# EAGLE design Braumister V.2.0 (EAGLE 6.1)
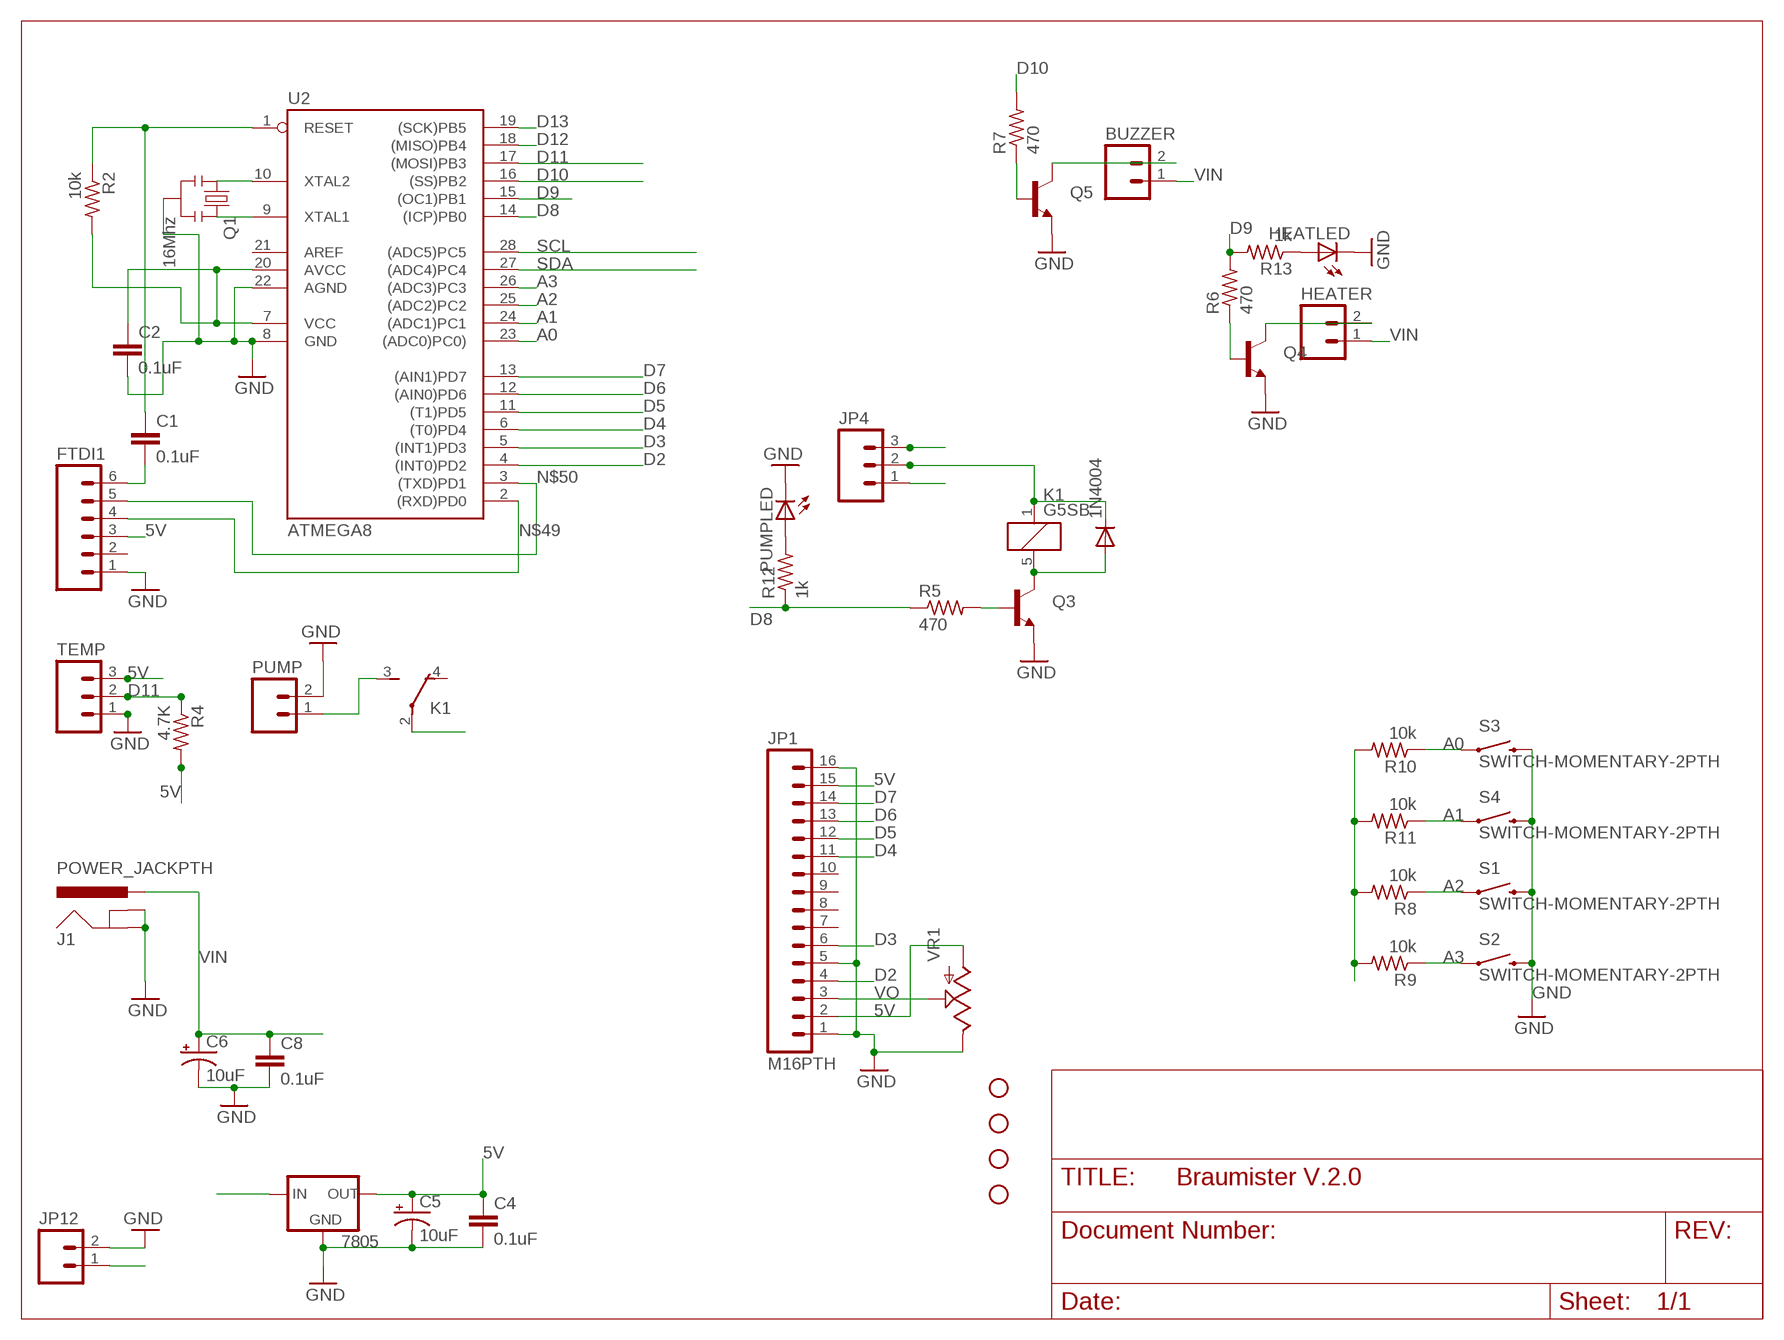
[diagram p0: schematic, sheet 1]

## Parts
1N4004  DIODEPTH  [DIODE-1N4001]
7805  V_REG_78XX  [TO220AHV]
BUZZER  M023.5MM  [SCREWTERMINAL-3.5MM-2]
C1  0.1uF  CAPPTH  [CAP-PTH-SMALL]
C2  0.1uF  CAPPTH  [CAP-PTH-SMALL]
C4  0.1uF  CAPPTH  [CAP-PTH-SMALL]
C5  10uF  CAP_POL6.3MMPTH  [CAP6.3MM2.5MM]
C6  10uF  CAP_POL6.3MMPTH  [CAP6.3MM2.5MM]
C8  0.1uF  CAPPTH  [CAP-PTH-SMALL]
FTDI1  M06SIP  [1X06]
HEATER  M023.5MM  [SCREWTERMINAL-3.5MM-2]
HEATLED  LED3MM  [LED3MM]
J1  POWER_JACKPTH  [POWER_JACK_PTH]
JP1  M16PTH  [1X16]
JP2  STAND-OFF  [STAND-OFF]
JP4  M03LOCK  [1X03_LOCK]
JP7  STAND-OFF  [STAND-OFF]
JP9  STAND-OFF  [STAND-OFF]
JP10  STAND-OFF  [STAND-OFF]
JP12  M02PTH  [1X02]
K1  G5SB  [G5SB]
PUMP  M023.5MM  [SCREWTERMINAL-3.5MM-2]
PUMPLED  LED3MM  [LED3MM]
Q1  16Mhz  RESONATORPTH  [RESONATOR-PTH]
Q3  TRANSISTOR_NPNTO-92-AMMO  [TO-92-AMMO]
Q4  TRANSISTOR_NPNTO-92-AMMO  [TO-92-AMMO]
Q5  TRANSISTOR_NPNTO-92-AMMO  [TO-92-AMMO]
R2  10k  R-US_0204/7  [0204/7]
R4  4.7K  R-US_0204/7  [0204/7]
R5  470  R-US_0204/7  [0204/7]
R6  470  R-US_0204/7  [0204/7]
R7  470  R-US_0204/7  [0204/7]
R8  10k  R-US_0204/7  [0204/7]
R9  10k  R-US_0204/7  [0204/7]
R10  10k  R-US_0204/7  [0204/7]
R11  10k  R-US_0204/7  [0204/7]
R12  1k  R-US_0204/7  [0204/7]
R13  1k  R-US_0204/7  [0204/7]
S1  SWITCH-MOMENTARY-2PTH  [TACTILE-PTH]
S2  SWITCH-MOMENTARY-2PTH  [TACTILE-PTH]
S3  SWITCH-MOMENTARY-2PTH  [TACTILE-PTH]
S4  SWITCH-MOMENTARY-2PTH  [TACTILE-PTH]
TEMP  M03SCREW  [SCREWTERMINAL-3.5MM-3]
U2  ATMEGA8  AT90S4433P  [DIL28-3]
VR1  POT  [TRIM_POT_SIDE]

## Nets
5V [Power]: 7805.E(OUT) C2.1 C4.1 C5.P$2(+) FTDI1.3 JP1.2 JP1.15 JP4.3 R2.2 R4.2 R8.2 R9.2 R10.2 R11.2 TEMP.3 U2.7(VCC) U2.20(AVCC) VR1.P$3(A)
A0: R10.1 S3.1 U2.23((ADC0)PC0))
A1: R11.1 S4.1 U2.24((ADC1)PC1)
A2: R8.1 S1.1 U2.25((ADC2)PC2)
A3: R9.1 S2.1 U2.26((ADC3)PC3)
D2: JP1.4 U2.4((INT0)PD2)
D3: JP1.6 U2.5((INT1)PD3)
D4: JP1.11 U2.6((T0)PD4)
D5: JP1.12 U2.11((T1)PD5)
D6: JP1.13 U2.12((AIN0)PD6)
D7: JP1.14 U2.13((AIN1)PD7)
D8: R5.1 R12.1 U2.14((ICP)PB0)
D9: R6.2 R13.2 U2.15((OC1)PB1)
D10: R7.2 U2.16((SS)PB2)
D11: R4.1 TEMP.2 U2.17((MOSI)PB3)
D12: U2.18((MISO)PB4)
D13: U2.19((SCK)PB5)
GND [Power]: 7805.C(GND) C2.2 C4.2 C5.P$1(-) C6.P$1(-) C8.2 FTDI1.1 HEATLED.K(C) J1.GND J1.GNDBREAK JP1.1 JP1.5 JP1.16 JP12.2 PUMP.2 PUMPLED.K(C) Q1.2 Q3.1(E) Q4.1(E) Q5.1(E) S1.3 S2.3 S3.3 S4.3 TEMP.1 U2.8(GND) U2.22(AGND) VR1.P$1(E)
N$4: Q5.2(B) R7.1
N$5: K1.3(U:S) PUMP.1
N$6: BUZZER.2 Q5.3(C)
N$7: 1N4004.C JP4.2 K1.1
N$8: 1N4004.A K1.5 Q3.3(C)
N$9: C1.1 R2.1 U2.1(RESET)
N$10: Q3.2(B) R5.2
N$11: HEATER.2 Q4.3(C)
N$12: Q4.2(B) R6.1
N$14: PUMPLED.A R12.2
N$15: HEATLED.A R13.1
N$36: Q1.3 U2.9(XTAL1)
N$38: Q1.1 U2.10(XTAL2)
N$49: FTDI1.4 U2.2((RXD)PD0)
N$50: FTDI1.5 U2.3((TXD)PD1)
N$51: C1.2 FTDI1.6
SCL: U2.28((ADC5)PC5)
SDA: U2.27((ADC4)PC4)
VIN [Power]: 7805.B(IN) BUZZER.1 C6.P$2(+) C8.1 HEATER.1 J1.PWR JP4.1 JP12.1 K1.2(U:P)
VO: JP1.3 VR1.P$2(S)
Unconnected: FTDI1.2 JP1.7 JP1.8 JP1.9 JP1.10 K1.4(U:O) U2.21(AREF)

## Library data of the parts
1N4004 = SparkFun:DIODE: Diode These are standard reverse protection diodes and small signal diodes. SMA package can handle up to about 1A. SOD-323 can handle about 200mA. What the SOD-323 package when ordering, there are some mfgs out there that are 5-pin packages.
7805 = _allyourbase:V_REG_78XX: Voltage Regulator Standard 7805 5V regulator. IGO (Input Ground Output). Spark Fun Electronics SKU : COM-00107
BUZZER HEATER PUMP = SparkFun:M02: Header 2 Standard 2-pin 0.1" header. Use with straight break away headers (SKU : PRT-00116), right angle break away headers (PRT-00553), swiss pins (PRT-00743), machine pins (PRT-00117), and female headers (PRT-00115). Molex polarized connector foot print use with SKU : PRT-08233 with associated crimp pins and housings.
C1 C2 C4 C8 = _allyourbase:CAP: Capacitor Standard 0603 ceramic capacitor, and 0.1" leaded capacitor.
C5 C6 = _allyourbase:CAP_POL: Capacitor Polarized These are standard SMD and PTH capacitors. Normally 10uF, 47uF, and 100uF in electrolytic and tantalum varieties. Always verify the external diameter of the through hole cap, it varies with capacity, voltage, and manufacturer. The EIA devices should be standard.
FTDI1 = _allyourbase:M06: Header 6 Standard 6-pin 0.1" header. Use with straight break away headers (SKU : PRT-00116), right angle break away headers (PRT-00553), swiss pins (PRT-00743), machine pins (PRT-00117), and female headers (PRT-00115). Molex polarized connector foot print use with SKU : PRT-08094 with associated crimp pins and housings. NOTES ON THE VARIANTS LOCK and LOCK_LONGPADS... This footprint was designed to help hold the alignment of a through-hole component (i.e. 6-pin header) while soldering it into place. You may notice that each hole has been shifted either up or down by 0.005 of an inch from it's more standard position (which is a perfectly straight line). This slight alteration caused the pins (the squares in the middle) to touch the edges of the holes. Because they are alternating, it causes a "brace" to hold the component in place. 0.005 has proven to be the perfect amount of "off-center" position when using our standard breakaway headers. Although looks a little odd when you look at the bare footprint, once you have a header in there, the alteration is very hard to notice. Also, if you push a header all the way into place, it is covered up entirely on the bottom side. This idea of altering the position of holes to aid alignment will be further integrated into the Sparkfun Library for other footprints. It can help hold any component with 3 or more connection pins.
HEATLED PUMPLED = adafruit:LED: LED OSRAM: - CHIPLED LG R971, LG N971, LY N971, LG Q971, LY Q971, LO R971, LY R971 LH N974, LH R974 LS Q976, LO Q976, LY Q976 LO Q996 - Hyper CHIPLED LW Q18S LB Q993, LB Q99A, LB R99A - SideLED LS A670, LO A670, LY A670, LG A670, LP A670 LB A673, LV A673, LT A673, LW A673 LH A674 LY A675 LS A676, LA A676, LO A676, LY A676, LW A676 LS A679, LY A679, LG A679 - Hyper Micro SIDELED® LS Y876, LA Y876, LO Y876, LY Y876 LT Y87S - SmartLED LW L88C, LW L88S LB L89C, LB L89S, LG L890 LS L89K, LO L89K, LY L89K LS L896, LA L896, LO L896, LY L896 - TOPLED LS T670, LO T670, LY T670, LG T670, LP T670 LSG T670, LSP T670, LSY T670, LOP T670, LYG T670 LG T671, LOG T671, LSG T671 LB T673, LV T673, LT T673, LW T673 LH T674 LS T676, LA T676, LO T676, LY T676, LB T676, LH T676, LSB T676, LW T676 LB T67C, LV T67C, LT T67C, LS T67K, LO T67K, LY T67K, LW E67C LS E67B, LA E67B, LO E67B, LY E67B, LB E67C, LV E67C, LT E67C LW T67C LS T679, LY T679, LG T679 LS T770, LO T770, LY T770, LG T770, LP T770 LB T773, LV T773, LT T773, LW T773 LH T774 LS E675, LA E675, LY E675, LS T675 LS T776, LA T776, LO T776, LY T776, LB T776 LHGB T686 LT T68C, LB T68C - Hyper Mini TOPLED® LB M676 - Mini TOPLED Santana® LG M470 LS M47K, LO M47K, LY M47K Source: http://www.osram.convergy.de/
J1 = _allyourbase:POWER_JACK: Power Jack This is the standard 5.5mm barrel jack for power. The PTH is the most common, proven, reliable, footprint. All others are experimental. The Slot footprint only works if the mill layer is transmitted to the PCB fab house so be warned. Spark Fun Electronics SKU : PRT-00119. Mating wall wart : TOL-00298 (and others)
JP1 = _allyourbase:M16
JP2 JP7 JP9 JP10 = _allyourbase:STAND-OFF: Stand Off This is the mechanical footprint for a #4 phillips button head screw. Use the keepout ring to avoid running the screw head into surrounding components. SKU : PRT-00447
JP4 TEMP = SparkFun:M03: Header 3 Standard 3-pin 0.1" header. Use with straight break away headers (SKU : PRT-00116), right angle break away headers (PRT-00553), swiss pins (PRT-00743), machine pins (PRT-00117), and female headers (PRT-00115). Molex polarized connector foot print use with SKU : PRT-08232 with associated crimp pins and housings.
JP12 = _allyourbase:M02: Header 2 Standard 2-pin 0.1" header. Use with straight break away headers (SKU : PRT-00116), right angle break away headers (PRT-00553), swiss pins (PRT-00743), machine pins (PRT-00117), and female headers (PRT-00115). Molex polarized connector foot print use with SKU : PRT-08233 with associated crimp pins and housings.
K1 = relay:G5SB: Compact Single-pole Relay for Switching 5 A Source: http://www.omron.com/ecb/products/pry/121/g5sb.html; OC_FARNELL: unknown; OC_NEWARK: unknown
Q1 = _allyourbase:RESONATOR: Resonator Small SMD resonator. This is the itty bitty 10/20MHz resonators with built in caps. CSTCE10M0G55 and CSTCE20M0V53. Footprint has been reviewed closely but hasn't been tested yet.
Q3-Q5 = SparkFun:TRANSISTOR_NPN: Transistor NPN BJT configuration in SOT23 package. MMBT2222 is the common NPN we use. Double check BCE configuration again layout.
R2 R4-R13 = _allyourbase:R-US_: RESISTOR, American symbol
S1-S4 = _allyourbase:SWITCH-MOMENTARY-2
U2 = atmel:AT90S4433: MICROCONTROLLER 4 Kbytes FLASH 128 bytes SRAM 256 bytes EEPROM UART 6-channel 10 bit ADC
VR1 = _allyourbase:POT

## Net classes
0 default: width 0.254 mm, drill 0.508 mm
1 Power: width 0.305 mm, drill 0.508 mm

## Board
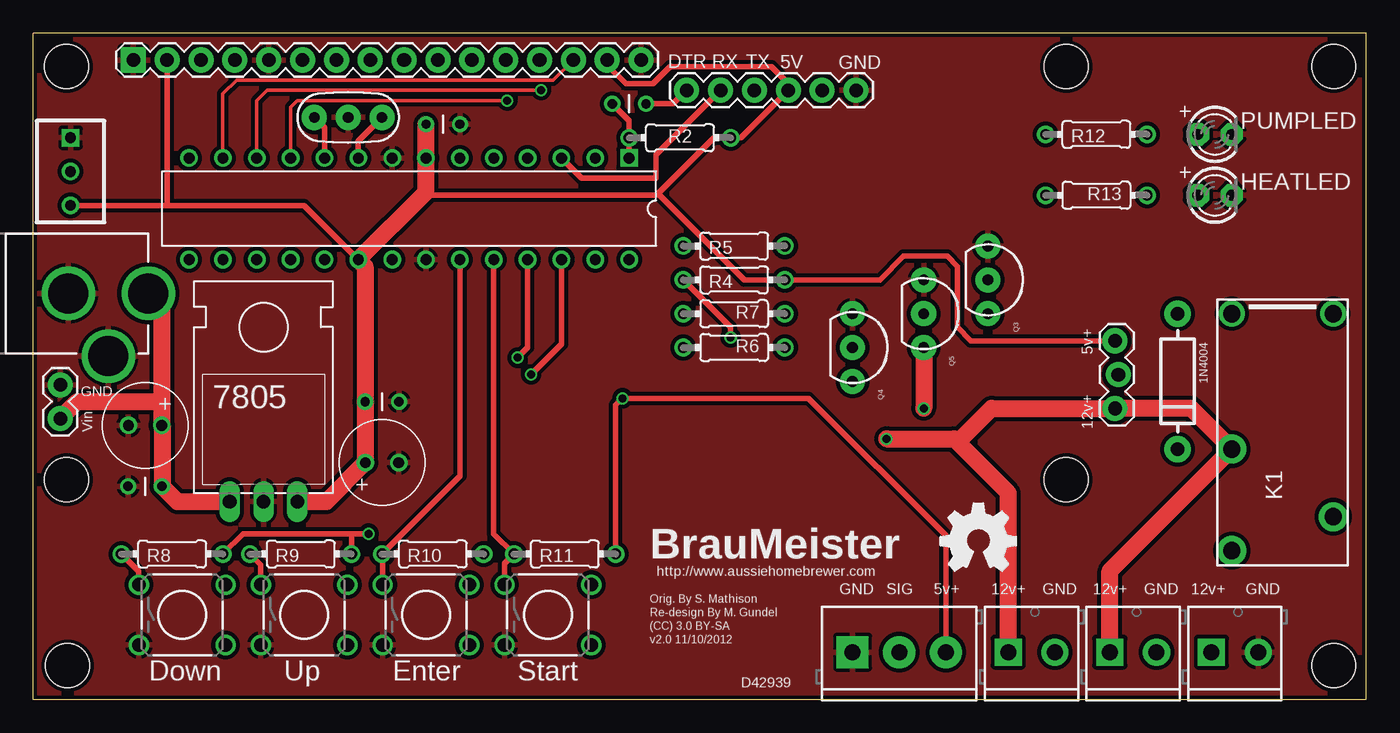
[diagram p1: board, top side]
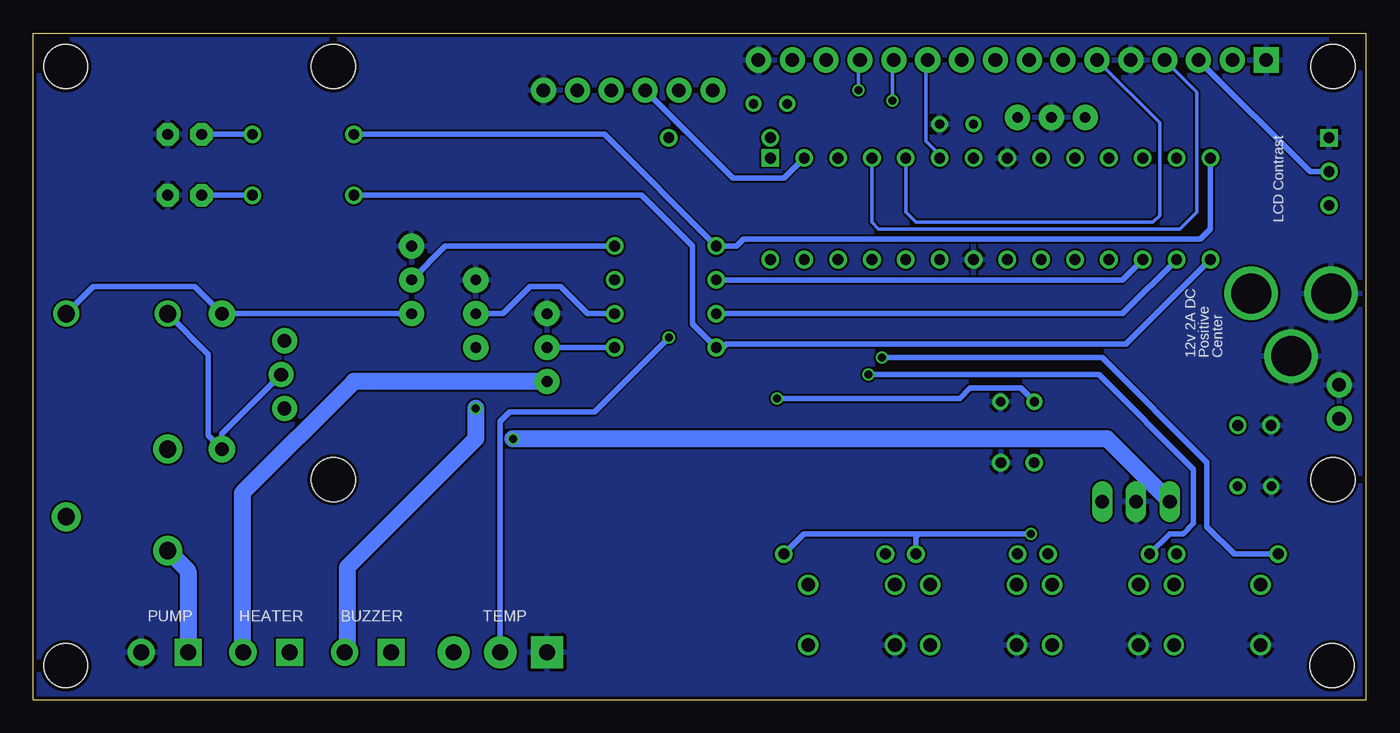
[diagram p2: board, bottom side, seen from below]

Size 100 x 50 mm. Coordinates in mm from the lower left corner, seen from the top.
Outline: 100,0 0,0 0,50 100,50 100,0
Copper layers (1*16): Top 0.035mm / dielectric 1.5mm / Bottom 0.035mm
Design rules: minimum track width 6mil, minimum drill 12mil, track to track 6mil, track to pad 6mil, pad to pad 6mil, via to via 6mil, smd to smd 0mil, copper to edge 10mil, drill to drill 10mil, minimum pad ring 10mil, minimum via ring 6mil, stop-mask expansion 2mil, vias tented up to drill 100mil, thermal gap 10mil

### Footprints (pad centres in the part's own frame; a part is rotated, then mirrored left to right if it is on the bottom)
DIODE-1N4001 = drill 1 pad 1.981: A -5.08,0; C 5.08,0
TO220AHV = drill 1.016 long: B -2.54,-1.905; C 0,-1.905; E 2.54,-1.905
SCREWTERMINAL-3.5MM-2 = drill 1.2 pad 2.032 square: 1 0,0 | drill 1.2 pad 2.032: 2 3.5,0
CAP-PTH-SMALL = drill 0.7: 1 0,0; 2 2.54,0
CAP6.3MM2.5MM = drill 0.8: P$1 -1.25,0; P$2 1.25,0
1X06 = drill 1.016 pad 1.88: 1 0,0; 2 2.54,0; 3 5.08,0; 4 7.62,0; 5 10.16,0; 6 12.7,0
LED3MM = drill 0.813 pad 1.676 octagon: A -1.27,0; K 1.27,0
POWER_JACK_PTH = drill 2.997: GND 0,7.7; GNDBREAK 4.7,10.7; PWR 0,13.7
1X16 = drill 1.016 pad 1.88 square: 1 0,0 | drill 1.016 pad 1.88: 2 2.54,0; 3 5.08,0; 4 7.62,0; 5 10.16,0; 6 12.7,0; 7 15.24,0; 8 17.78,0; 9 20.32,0; 10 22.86,0; 11 25.4,0; 12 27.94,0; 13 30.48,0; 14 33.02,0; 15 35.56,0; 16 38.1,0
STAND-OFF = hole 3.302: 0,0
1X03_LOCK = drill 1.016 pad 1.88: 1 0,0.127; 2 2.54,-0.127; 3 5.08,0.127
1X02 = drill 1.016 pad 1.88: 1 0,0; 2 2.54,0
G5SB = drill 1.3 pad 1.93: 1 7.62,3.81; 5 7.62,-3.81 | drill 1.3 pad 2.184: 2 -2.54,3.81; 3 -10.16,3.81; 4 -7.62,-3.81
RESONATOR-PTH = drill 0.8 pad 1.88: 1 -2.54,0; 2 0,0; 3 2.54,0
TO-92-AMMO = drill 0.813 pad 1.88: 1 -2.54,0; 2 0,0; 3 2.54,0
0204/7 = drill 0.813: 1 -3.81,0; 2 3.81,0
TACTILE-PTH = drill 1.016: 1 -3.251,2.261; 2 3.251,2.261; 3 -3.251,-2.261; 4 3.251,-2.261
SCREWTERMINAL-3.5MM-3 = drill 1.2 pad 2.413 square: 1 0,0 | drill 1.2 pad 2.413: 2 3.5,0; 3 7,0
DIL28-3 = drill 0.813 square: 1 -16.51,-3.81 | drill 0.813: 2 -13.97,-3.81; 3 -11.43,-3.81; 4 -8.89,-3.81; 5 -6.35,-3.81; 6 -3.81,-3.81; 7 -1.27,-3.81; 8 1.27,-3.81; 9 3.81,-3.81; 10 6.35,-3.81; 11 8.89,-3.81; 12 11.43,-3.81; 13 13.97,-3.81; 14 16.51,-3.81; 15 16.51,3.81; 16 13.97,3.81; 17 11.43,3.81; 18 8.89,3.81; 19 6.35,3.81; 20 3.81,3.81; 21 1.27,3.81; 22 -1.27,3.81; 23 -3.81,3.81; 24 -6.35,3.81; 25 -8.89,3.81; 26 -11.43,3.81; 27 -13.97,3.81; 28 -16.51,3.81
TRIM_POT_SIDE = drill 0.8 square: P$1 0,2.54 | drill 0.8: P$2 0,0; P$3 0,-2.54

### Placement (x,y rotation side)
1N4004  85.85,23.88 270 top
7805  17.27,16.76 0 top
BUZZER  73.15,3.56 0 top
C1  43.43,44.7 0 top
C2  29.46,43.18 0 top
C4  24.89,22.35 0 top
C5  26.16,17.78 180 top
C6  8.38,20.57 0 top
C8  9.65,16 180 top
FTDI1  61.72,45.72 180 top
HEATER  80.77,3.56 0 top
HEATLED  88.65,37.85 0 top
J1  -5.08,30.48 270 top
JP1  7.5,48 0 top
JP2  2.5,47.5 0 top
JP3  STAND-OFF  [STAND-OFF]  77.5,47.5 0 top
JP4  81.28,21.84 90 top
JP5  STAND-OFF  [STAND-OFF]  97.57,47.5 0 top
JP6  STAND-OFF  [STAND-OFF]  97.57,2.54 0 top
JP7  2.57,2.54 0 top
JP9  2.5,16.5 0 top
JP10  77.5,16.5 0 top
JP12  2.03,21.08 90 top
K1  93.73,21.34 90 top
PUMP  88.39,3.56 0 top
PUMPLED  88.65,42.42 0 top
Q1  23.62,43.69 0 top
Q3  71.63,31.5 270 top
Q4  61.47,26.42 270 top
Q5  66.8,28.96 270 top
R2  48.51,42.16 0 top
R4  52.58,31.5 0 top
R5  52.58,34.04 0 top
R6  52.58,26.42 180 top
R7  52.58,28.96 180 top
R8  10.41,10.92 0 top
R9  20.07,10.92 0 top
R10  29.97,10.92 0 top
R11  39.88,10.92 0 top
R12  79.76,42.42 0 top
R13  79.76,37.85 180 top
S1  11.18,6.35 0 top
S2  20.32,6.35 0 top
S3  29.46,6.35 0 top
S4  38.61,6.35 0 top
TEMP  61.47,3.56 0 top
U2  28.19,36.83 180 top
U$2  [OSHW_FILLX200_NOTEXT]  68.07,9.65 0 top
VR1  2.79,39.62 0 top

### Tracks (layer width: path | path; a pad name or v marks a point on that pad's centre or on a via)
5V  (via drill 0.6)
  Top 0.406: VR1.P$3 10.16,37.08 | 10.16,37.08 20.32,37.08 U2.20 | JP1.2 10.04,37.2 10.16,37.08 | 46.86,37.97 51.05,42.16 R2.2 53.09,42.16 FTDI1.3 56.64,46.23 55.37,47.5 47.75,47.5 46.48,46.23 44.45,46.23 43.06,47.62 JP1.15 | 46.86,37.97 46.74,37.85 29.72,37.85 29.46,38.1 | 46.86,37.97 53.34,31.5 R4.2 63.5,31.5 65.28,33.27 68.58,33.27 69.34,32.51 69.34,27.94 70.36,26.92 JP4.3 | TEMP.3 68.47,12.3 58.17,22.61 v44.2,22.61 43.69,22.1 R11.2 | R8.2 15.75,12.45 23.88,12.45 | 23.88,12.45 v25.15,12.45 | R9.2 23.88,12.45
  Top 1.27: 7805.E 21.99,14.86 C5.P$2 24.91,22.33 C4.1 24.89,32.51 U2.20 29.46,38.1 U2.7 C2.1
  Bottom 0.406: v44.2,22.61 30.48,22.61 29.72,23.37 25.91,23.37 C4.1 | v25.15,12.45 33.53,12.45 | 33.53,12.45 42.16,12.45 R11.2 | R10.2 33.78,12.19 33.53,12.45
  other vias: 43.69,10.92
A0
  Top 0.406: S3.1 26.21,10.87 R10.1 32,16.76 U2.23
A1
  Top 0.406: S4.1 35.36,10.21 R11.1 34.54,12.45 U2.24
A2  (via drill 0.6)
  Top 0.406: S1.1 7.92,9.6 R8.1 | U2.25 37.08,26.42 v36.32,25.65
  Bottom 0.406: v36.32,25.65 19.81,25.65 11.94,17.78 11.94,12.95 9.91,10.92 R8.1
A3  (via drill 0.6)
  Top 0.406: S2.1 17.07,10.11 R9.1 | U2.26 39.62,26.67 v37.34,24.38
  Bottom 0.406: v37.34,24.38 20.07,24.38 12.95,17.27 12.95,13.21 13.72,12.45 14.73,12.45 R9.1
D2
  Bottom 0.254: U2.4 37.08,35.81 36.58,35.31 13.97,35.31 12.7,36.58 12.7,45.58 JP1.4
D3
  Bottom 0.254: U2.5 34.54,36.58 33.78,35.81 16,35.81 15.49,36.32 15.49,43.29 JP1.6
D4
  Bottom 0.254: U2.6 32,40.89 33.02,41.91 33.02,47.88 JP1.11
D5  (via drill 0.6)
  Top 0.254: U2.11 19.3,44.45 19.81,44.96 v35.56,44.96
  Bottom 0.254: v35.56,44.96 35.56,47.88 JP1.12
D6  (via drill 0.6)
  Top 0.254: U2.12 16.76,44.96 17.53,45.72 v38.1,45.72
  Bottom 0.254: v38.1,45.72 38.1,47.88 JP1.13
D7
  Top 0.254: U2.13 14.22,45.47 15.24,46.48 39,46.48 JP1.14
D8
  Bottom 0.406: R12.1 57.15,42.42 R5.1 47.24,34.04 46.74,34.54 12.45,34.54 11.68,35.31 U2.14
D9
  Bottom 0.406: U2.15 18.03,26.67 48.01,26.67 48.26,26.42 R6.2 | R6.2 49.02,26.42 | R13.2 54.36,37.85 50.55,34.04 50.55,28.19 R6.2
D10
  Bottom 0.406: U2.16 18.29,28.96 R7.2
D11  (via drill 0.6)
  Top 0.406: v52.32,27.18 52.32,27.94 R4.1
  Bottom 0.406: U2.17 18.29,31.5 R4.1 | TEMP.2 64.97,20.88 64.26,21.59 57.91,21.59 v52.32,27.18
GND
  pour Top (isolate 0.305): 0,50.04 0,0 100,0 100,50
  pour Bottom: 0,0 100,0 100,50 72.64,50.04 0,50.04
N$4
  Bottom 0.406: R7.1 58.42,28.96 60.45,30.99 62.74,30.99 64.77,28.96 Q5.2
N$5
  Bottom 1.27: K1.3 88.39,9.65 PUMP.1
N$6  (via drill 0.6)
  Top 1.27: Q5.3 v66.8,21.84
  Bottom 1.27: v66.8,21.84 66.8,19.56 76.45,9.91 76.45,3.75 BUZZER.2
N$7
  Bottom 0.406: JP4.2 85.85,19.94 1N4004.C 86.87,19.81 86.87,25.91 K1.1
N$8
  Bottom 0.406: Q3.3 1N4004.A 87.88,30.99 95.5,30.99 K1.5
N$9
  Top 0.406: C1.1 44.7,43.43 R2.1 U2.1
N$10
  Bottom 0.406: R5.2 69.09,34.04 Q3.2
N$11
  Bottom 0.254: HEATER.2 83.82,3.81 84.33,3.81
  Bottom 1.27: Q4.3 75.95,23.88 84.33,15.49 84.33,3.81 84.33,3.56
N$12
  Bottom 0.406: R6.1 Q4.2
N$14
  Bottom 0.406: R12.2 PUMPLED.A
N$15
  Bottom 0.406: R13.1 HEATLED.A
N$36
  Top 0.406: U2.9 24.38,41.91 Q1.3
N$38
  Top 0.406: U2.10 21.84,42.93 Q1.1
N$49
  Bottom 0.406: FTDI1.4 47.5,39.12 43.69,39.12 U2.2
N$50
  Top 0.406: FTDI1.5 46.74,40.89 46.74,39.12 41.15,39.12 U2.3
N$51
  Top 0.406: FTDI1.6 48.01,44.7 C1.2
VIN  (via drill 0.6)
  Top 1.27: J1.PWR 9.63,29.47 9.63,22.35 | 9.63,22.35 C6.P$2 9.65,20.55 C8.1 10.79,14.86 7805.B | JP12.1 3.3,22.35 9.63,22.35 | HEATER.1 80.77,9.65 K1.2 86.87,21.84 JP4.1 71.88,21.84 69.6,19.56 69.09,19.56 | v64.01,19.56 69.09,19.56 | BUZZER.1 73.15,15.49 69.09,19.56
  Bottom 1.27: 7805.B 19.43,19.56 v64.01,19.56
VO
  Bottom 0.406: VR1.P$2 4.2,39.62 JP1.3

### Text on the board
tNames: DTR | RX | TX | 5V | GND | 5v+ | GND | Vin | 12v+ | BrauMeister | http://www.aussiehomebrewer.com | GND | SIG | 5v+ | 12v+ | GND | 12v+ | GND | 12v+ | GND | Orig. By S. Mathison | Re-design By M. Gundel | (CC) 3.0 BY-SA | v2.0 11/10/2012 | Down | Up | Enter | Start | D42939
bNames: LCD Contrast | Center | Positive | 12v 2A DC